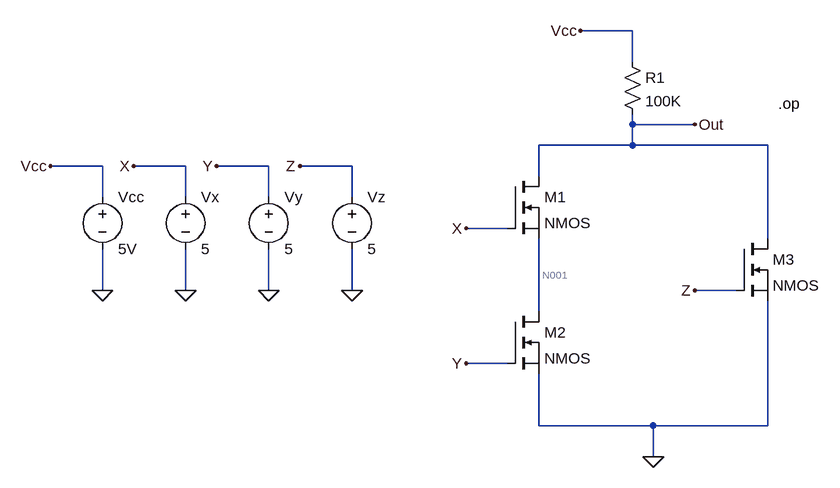
[diagram p0: schematic EXP 6 TASK 2.asc]
EXP 6 TASK 2.asc, the LTspice schematic file:
Version 4
SHEET 1 880 680
WIRE 320 -144 240 -144
WIRE 320 -96 320 -144
WIRE 320 0 320 -16
WIRE 416 0 320 0
WIRE 320 32 320 0
WIRE 320 32 176 32
WIRE 528 32 320 32
WIRE -496 64 -576 64
WIRE -368 64 -448 64
WIRE -240 64 -320 64
WIRE -112 64 -192 64
WIRE 176 80 176 32
WIRE -496 112 -496 64
WIRE -368 112 -368 64
WIRE -240 112 -240 64
WIRE -112 112 -112 64
WIRE 128 160 64 160
WIRE 528 176 528 32
WIRE -496 256 -496 192
WIRE -368 256 -368 192
WIRE -240 256 -240 192
WIRE -112 256 -112 192
WIRE 480 256 416 256
WIRE 176 288 176 176
WIRE 128 368 64 368
WIRE 176 464 176 384
WIRE 352 464 176 464
WIRE 528 464 528 272
WIRE 528 464 352 464
WIRE 352 512 352 464
FLAG -496 256 0
FLAG -368 256 0
FLAG -240 256 0
FLAG -112 256 0
FLAG 64 160 X
FLAG 64 368 Y
FLAG 416 256 Z
FLAG 240 -144 Vcc
FLAG 352 512 0
FLAG -448 64 X
FLAG -320 64 Y
FLAG -192 64 Z
FLAG -576 64 Vcc
FLAG 416 0 Out
SYMBOL nmos 128 80 R0
SYMATTR InstName M1
SYMBOL nmos 128 288 R0
SYMATTR InstName M2
SYMBOL nmos 480 176 R0
SYMATTR InstName M3
SYMBOL res 304 -112 R0
SYMATTR InstName R1
SYMATTR Value 100K
SYMBOL voltage -496 96 R0
SYMATTR InstName Vcc
SYMATTR Value 5V
SYMBOL voltage -368 96 R0
SYMATTR InstName Vx
SYMATTR Value 5
SYMBOL voltage -240 96 R0
SYMATTR InstName Vy
SYMATTR Value 5
SYMBOL voltage -112 96 R0
SYMATTR InstName Vz
SYMATTR Value 5
TEXT 544 -32 Left 2 !.op

The netlist it stands for:
* EXP 6 TASK 2.asc
M1 Out X N001 N001 NMOS
M2 N001 Y 0 0 NMOS
M3 Out Z 0 0 NMOS
R1 Vcc Out 100K
Vcc Vcc 0 5V
Vx X 0 5
Vy Y 0 5
Vz Z 0 5
.model NMOS NMOS
.model PMOS PMOS
.lib standard.mos
.op
.backanno
.end

* Results of the author's LTspice run, read from the files saved beside the schematic
* Operating Point:
*   V(out) = 322.2 mV
*   V(x) = 5 V
*   V(n001) = 158.4 mV
*   V(y) = 5 V
*   V(z) = 5 V
*   V(vcc) = 5 V
*   Id(M3) = 31.19 µA
*   Ig(M3) = 0 A
*   Ib(M3) = -332.2 fA
*   Is(M3) = -31.19 µA
*   Id(M2) = 15.59 µA
*   Ig(M2) = 0 A
*   Ib(M2) = -168.4 fA
*   Is(M2) = -15.59 µA
*   Id(M1) = 15.59 µA
*   Ig(M1) = 0 A
*   Ib(M1) = -173.8 fA
*   Is(M1) = -15.59 µA
*   I(R1) = 46.78 µA
*   I(Vz) = 0 A
*   I(Vy) = 0 A
*   I(Vx) = 0 A
*   I(Vcc) = -46.78 µA
* From the log:
*   Semiconductor Device Operating Points:
*                           --- MOSFET Transistors ---
*   Name:          m3          m2          m1
*   Model:        nmos        nmos        nmos
*   Id:          3.12e-05    1.56e-05    1.56e-05
*   Vgs:         5.00e+00    5.00e+00    4.84e+00
*   Vds:         3.22e-01    1.58e-01    1.64e-01
*   Vbs:         0.00e+00    0.00e+00    0.00e+00
*   Vth:         0.00e+00    0.00e+00    0.00e+00
*   Vdsat:       5.00e+00    5.00e+00    4.84e+00
*   Gm:          6.44e-06    3.17e-06    3.28e-06
*   Gds:         9.36e-05    9.68e-05    9.36e-05
*   Gmb:         0.00e+00    0.00e+00    0.00e+00
*   Cbd:         0.00e+00    0.00e+00    0.00e+00
*   Cbs:         0.00e+00    0.00e+00    0.00e+00
*   Cgsov:       0.00e+00    0.00e+00    0.00e+00
*   Cgdov:       0.00e+00    0.00e+00    0.00e+00
*   Cgbov:       0.00e+00    0.00e+00    0.00e+00
*   Cgs:         0.00e+00    0.00e+00    0.00e+00
*   Cgd:         0.00e+00    0.00e+00    0.00e+00
*   Cgb:         0.00e+00    0.00e+00    0.00e+00